# Altium schematic sheet RelayBoard.SchDoc
size A
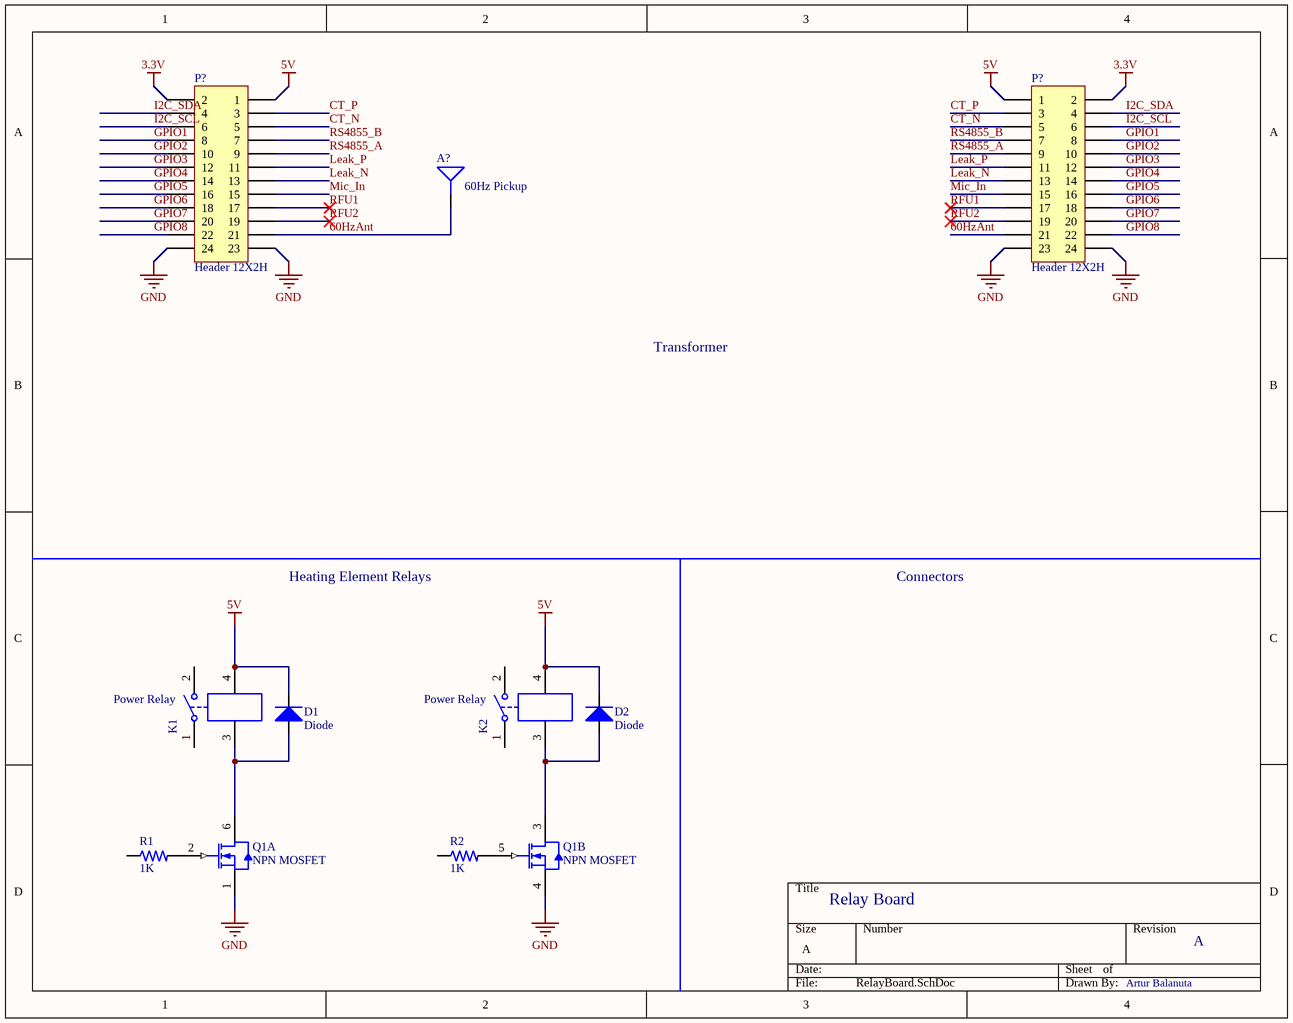
[diagram p0: RelayBoard.SchDoc]

## Parts
(Parts that share a designator on the sheet are numbered #1, #2 ... from top to bottom, then left to right.)
A?  60Hz Pickup  [60HzPickup]
D1  Diode  [SOD-80  MiniMELF]
D2  Diode  [SOD-80  MiniMELF]
K1  Power Relay  [T9AS1D12-5]
K2  Power Relay  [T9AS1D12-5]
P?#1  Header 12X2H  [HDR2X12H]
P?#2  Header 12X2H  [HDR2X12H]
Q1  NPN MOSFET  [SC-70-6  (SOT-363)]  (parts A,B of 2)
R1  1K  [RESC1608X06L - RES0603]
R2  1K  [RESC1608X06L - RES0603]

## Nets
3.3V: P?#1.2 P?#2.2
5V: D1.1(K) D2.1(K) K1.4 K2.4 P?#1.1 P?#2.1
GND: P?#1.23 P?#1.24 P?#2.23 P?#2.24 Q1.1(S1) Q1.4(S2)
60HzAnt: A?.1(Ant) P?#1.21 P?#2.21
CT_N: P?#1.5 P?#2.5
CT_P: P?#1.3 P?#2.3
GPIO1: P?#1.8 P?#2.8
GPIO2: P?#1.10 P?#2.10
GPIO3: P?#1.12 P?#2.12
GPIO4: P?#1.14 P?#2.14
GPIO5: P?#1.16 P?#2.16
GPIO6: P?#1.18 P?#2.18
GPIO7: P?#1.20 P?#2.20
GPIO8: P?#1.22 P?#2.22
I2C_SCL: P?#1.6 P?#2.6
I2C_SDA: P?#1.4 P?#2.4
Leak_N: P?#1.13 P?#2.13
Leak_P: P?#1.11 P?#2.11
Mic_In: P?#1.15 P?#2.15
RFU1: P?#1.17 P?#2.17
RFU2: P?#1.19 P?#2.19
RS4855_A: P?#1.9 P?#2.9
RS4855_B: P?#1.7 P?#2.7
NetD1_2: D1.2(A) K1.3 Q1.6(D1)
NetD2_2: D2.2(A) K2.3 Q1.3(D2)
NetQ1_2: Q1.2(G1) R1.2
NetQ1_5: Q1.5(G2) R2.2

Not connected (* = marked no-connect by the designer): K1 1 2; K2 1 2; R1 1; R2 1

## Notes on the sheet
- Transformer
- Heating Element Relays
- Connectors
- Relay Board
- A
- Artur Balanuta

## Library data of the parts
A? = 60Hz pickup with via: 5cm 60Hz pickup antenna with via for external wire
D1 D2 = Diode LL4150GS18: DIODE GEN 50V 600MA MINI MELF; Supplier 1: Digi-Key; Supplier Part Number 1: LL4150GS18GICT-ND
K1 K2 = T9AS1D12-5: Single-Pole Single-Throw Relay; Supplier 1: Digi-Key; Supplier Part Number 1: PB1014-ND; Part Number: T9AS1D12-5
P?#1 P?#2 = Header 12X2H: Header, 12-Pin, Dual row, Right Angle; LatestRevisionDate: 17-Jul-2002; LatestRevisionNote: Re-released for DXP Platform.; Publisher: Altium Limited
Q1 = SI1922EDH-T1-GE3CT: 2N-CH NPN MOSFET 20V 1.3A SOT-363; Supplier 1: Digi-Key; Supplier Part Number 1: SI1922EDH-T1-GE3CT-ND
R1 R2 = RES0603 1K 1% 1/10W: SMT 0603 Ceramic Resistor; Power: 1/10W; Tolerance: 1%; Value: 1K; Supplier 1: Digi-Key; Supplier 2: Digi-Key; Supplier 3: Digi-Key; Supplier Part Number 1: 311-1.00KHRCT-ND; Supplier Part Number 2: P1.00KHCT-ND; Supplier Part Number 3: RMCF0603FG1K00CT-ND